# Altium schematic sheet Analog power.SchDoc
size A4
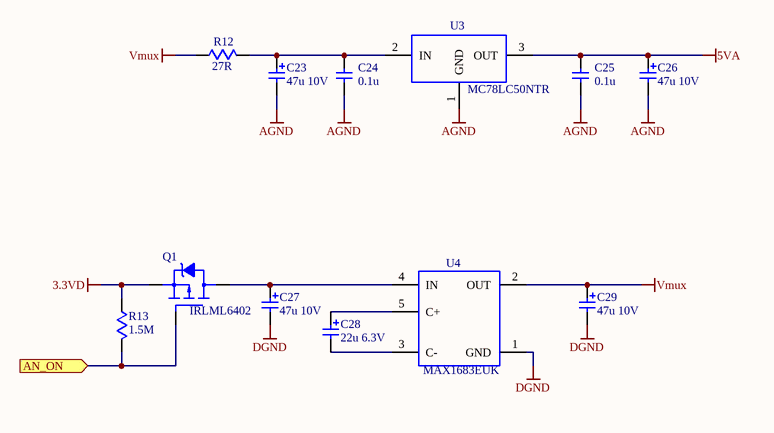
[diagram p0: Analog power.SchDoc]

## Parts
C23  47u 10V  [SMD/C/TAJ-B]
C24  0.1u  [SMD/C/0603]
C25  0.1u  [SMD/C/0603]
C26  47u 10V  [SMD/C/TAJ-B]
C27  47u 10V  [SMD/C/TAJ-B]
C28  22u 6.3V  [SMD/C/TAJ-A]
C29  47u 10V  [SMD/C/TAJ-B]
Q1  IRLML6402  [SMD/SOT23]
R12  27R  [SMD/R/0603]
R13  1.5M  [SMD/R/0603]
U3  MC78LC50NTR  [SMD/SOT23-5]
U4  MAX1683EUK  [SMD/SOT23-5]

## Ports
AN_ON (in)

## Nets
3.3VD: Q1.2(S) R13.1
5VA: C25.2 C26.P U3.3(OUT)
AGND: C23.M C24.1 C25.1 C26.M U3.1(GND)
DGND: C27.M C29.M U4.1(GND)
Vmux: C29.P R12.1 U4.2(OUT)
AN_ON: Q1.1(G) R13.2 ; port AN_ON
NetC23_P: C23.P C24.2 R12.2 U3.2(IN)
NetC27_P: C27.P Q1.3(D) U4.4(IN)
NetC28_M: C28.M U4.3(C-)
NetC28_P: C28.P U4.5(C+)

## Library data of the parts
C23 C26-C29 = Capacitor Pol
  C23 C26 C27 C29: Value: 47u 10V
  C28: Value: 22u 6.3V
C24 C25 = Capacitor: Value: 0.1u
Q1 = IRLML6402: P-channel HEXFET Power MOSFET; Value: IRLML6402
R12 R13 = Resistor
  R12: Value: 27R
  R13: Value: 1.5M
U3 = MC78LC50NTR: Micropower Ultra-Low Quiescent Current Voltage Regulator; Value: MC78LC50NTR
U4 = MAX1683EUK: Switched-Capacitor Voltage Doubler; Value: MAX1683EUK